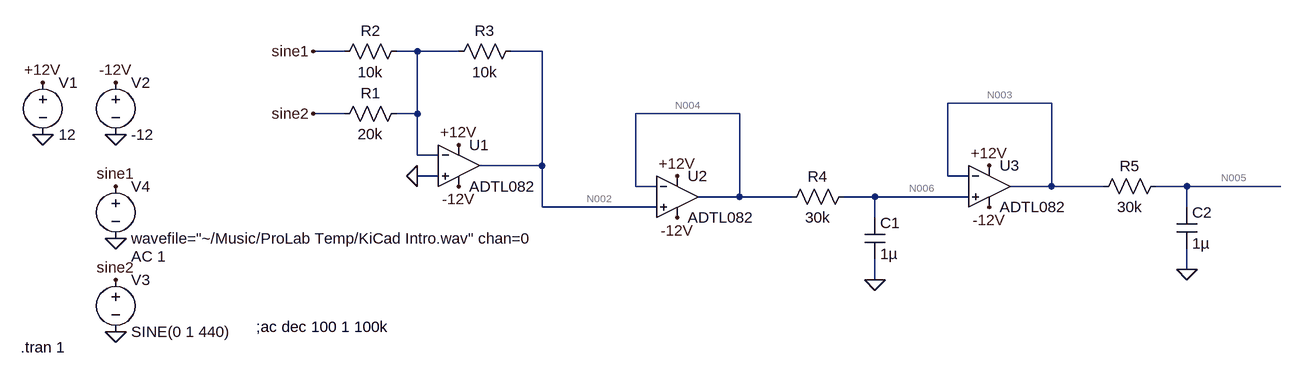
[diagram p0: schematic Draft1.asc]
Draft1.asc, the LTspice schematic file:
Version 4
SHEET 1 1844 680
WIRE 400 32 352 32
WIRE 512 32 480 32
WIRE 576 32 512 32
WIRE 704 32 656 32
WIRE 1488 112 1328 112
WIRE 400 128 352 128
WIRE 512 128 512 32
WIRE 512 128 480 128
WIRE 1008 128 848 128
WIRE 512 192 512 128
WIRE 544 192 512 192
WIRE 704 208 704 32
WIRE 704 208 608 208
WIRE 544 224 512 224
WIRE 1328 224 1328 112
WIRE 1360 224 1328 224
WIRE 848 240 848 128
WIRE 880 240 848 240
WIRE 1488 240 1488 112
WIRE 1488 240 1424 240
WIRE 1568 240 1488 240
WIRE 1696 240 1648 240
WIRE 1840 240 1696 240
WIRE 1008 256 1008 128
WIRE 1008 256 944 256
WIRE 1088 256 1008 256
WIRE 1216 256 1168 256
WIRE 1360 256 1216 256
WIRE 704 272 704 208
WIRE 880 272 704 272
WIRE 1696 272 1696 240
WIRE 1216 288 1216 256
WIRE 1696 368 1696 336
WIRE 1216 384 1216 352
FLAG -64 160 0
FLAG 48 160 0
FLAG -64 80 +12V
FLAG 48 80 -12V
FLAG 576 176 +12V
FLAG 576 240 -12V
FLAG 48 464 0
FLAG 48 320 0
FLAG 512 224 0
FLAG 48 240 sine1
FLAG 48 384 sine2
FLAG 352 32 sine1
FLAG 352 128 sine2
FLAG 912 224 +12V
FLAG 912 288 -12V
FLAG 1216 384 0
FLAG 1392 208 +12V
FLAG 1392 272 -12V
FLAG 1696 368 0
SYMBOL voltage -64 64 R0
WINDOW 123 0 0 Left 0
WINDOW 39 0 0 Left 0
SYMATTR InstName V1
SYMATTR Value 12
SYMBOL voltage 48 64 R0
WINDOW 123 0 0 Left 0
WINDOW 39 0 0 Left 0
SYMATTR InstName V2
SYMATTR Value -12
SYMBOL OpAmps\\ADTL082 576 144 R0
SYMATTR InstName U1
SYMBOL voltage 48 368 R0
WINDOW 123 0 0 Left 0
WINDOW 39 0 0 Left 0
SYMATTR InstName V3
SYMATTR Value SINE(0 1 440)
SYMBOL voltage 48 224 R0
WINDOW 123 24 124 Left 2
WINDOW 39 0 0 Left 0
SYMATTR InstName V4
SYMATTR Value wavefile="~/Music/ProLab Temp/KiCad Intro.wav" chan=0
SYMATTR Value2 AC 1
SYMBOL res 496 112 R90
WINDOW 0 0 56 VBottom 2
WINDOW 3 32 56 VTop 2
SYMATTR InstName R1
SYMATTR Value 20k
SYMBOL res 496 16 R90
WINDOW 0 0 56 VBottom 2
WINDOW 3 32 56 VTop 2
SYMATTR InstName R2
SYMATTR Value 10k
SYMBOL res 672 16 R90
WINDOW 0 0 56 VBottom 2
WINDOW 3 32 56 VTop 2
SYMATTR InstName R3
SYMATTR Value 10k
SYMBOL OpAmps\\ADTL082 912 192 R0
SYMATTR InstName U2
SYMBOL res 1184 240 R90
WINDOW 0 0 56 VBottom 2
WINDOW 3 32 56 VTop 2
SYMATTR InstName R4
SYMATTR Value 30k
SYMBOL cap 1200 288 R0
SYMATTR InstName C1
SYMATTR Value 1µ
SYMBOL OpAmps\\ADTL082 1392 176 R0
SYMATTR InstName U3
SYMBOL res 1664 224 R90
WINDOW 0 0 56 VBottom 2
WINDOW 3 32 56 VTop 2
SYMATTR InstName R5
SYMATTR Value 30k
SYMBOL cap 1680 272 R0
SYMATTR InstName C2
SYMATTR Value 1µ
TEXT -98 488 Left 2 !.tran 1
TEXT 264 456 Left 2 !;ac dec 100 1 100k

The netlist it stands for:
* Draft1.asc
V1 +12V 0 12
V2 -12V 0 -12
XU1 0 N001 +12V -12V N002 ADTL082  ; pins In+ In- V+ V- OUT
V3 sine2 0 SINE(0 1 440)
V4 sine1 0 wavefile="~/Music/ProLab Temp/KiCad Intro.wav" chan=0 AC 1
R1 N001 sine2 20k
R2 N001 sine1 10k
R3 N002 N001 10k
XU2 N002 N004 +12V -12V N004 ADTL082  ; pins In+ In- V+ V- OUT
R4 N006 N004 30k
C1 N006 0 1µ
XU3 N006 N003 +12V -12V N003 ADTL082  ; pins In+ In- V+ V- OUT
R5 N005 N003 30k
C2 N005 0 1µ
.tran 1
;ac dec 100 1 100k
.lib ADI.lib
.backanno
.end

* Results of the author's LTspice run, read from the files saved beside the schematic
* Operating Point, zero values left out:
*   V(+12v) = 12 V
*   V(-12v) = -12 V
*   V(n002) = 20 nV
*   V(n004) = 20 nV
*   V(n006) = -40 nV
*   V(n003) = -40 nV
*   V(n005) = -40 nV
*   I(R4) = -2 pA
*   I(R3) = 2 pA
*   I(V2) = 15.17 mA
*   I(V1) = -15.17 mA
*   Ix(u1:1) = 2 pA
*   Ix(u1:2) = 2 pA
*   Ix(u1:3) = 5.055 mA
*   Ix(u1:4) = -5.055 mA
*   Ix(u1:5) = -4 pA
*   Ix(u2:1) = 2 pA
*   Ix(u2:2) = 2 pA
*   Ix(u2:3) = 5.055 mA
*   Ix(u2:4) = -5.055 mA
*   Ix(u2:5) = -4 pA
*   Ix(u3:1) = 2 pA
*   Ix(u3:2) = 2 pA
*   Ix(u3:3) = 5.055 mA
*   Ix(u3:4) = -5.055 mA
*   Ix(u3:5) = -2 pA
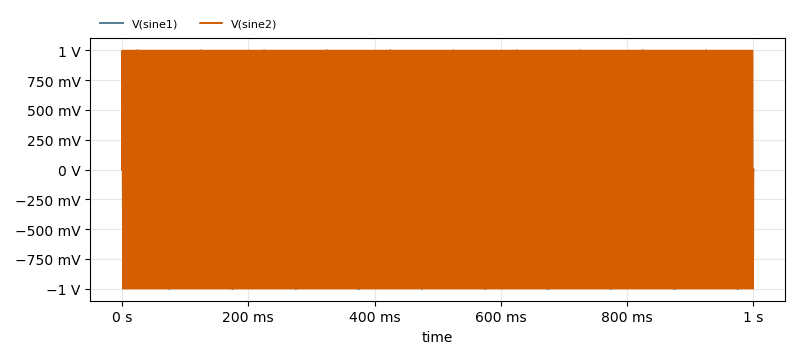
[diagram p1: Transient Analysis of Draft1.asc, plotted from the saved traces]
* Transient Analysis, 1 run:
*   V(sine1): min -1 V, max 1 V, average 0 V, rms 707.1 mV, last 0 V
*   V(sine2): min -999.8 mV, max 999.8 mV, average -373.1 nV, rms 718.7 mV, last 0 V